# Altium project KorreKthor.PrjPcb
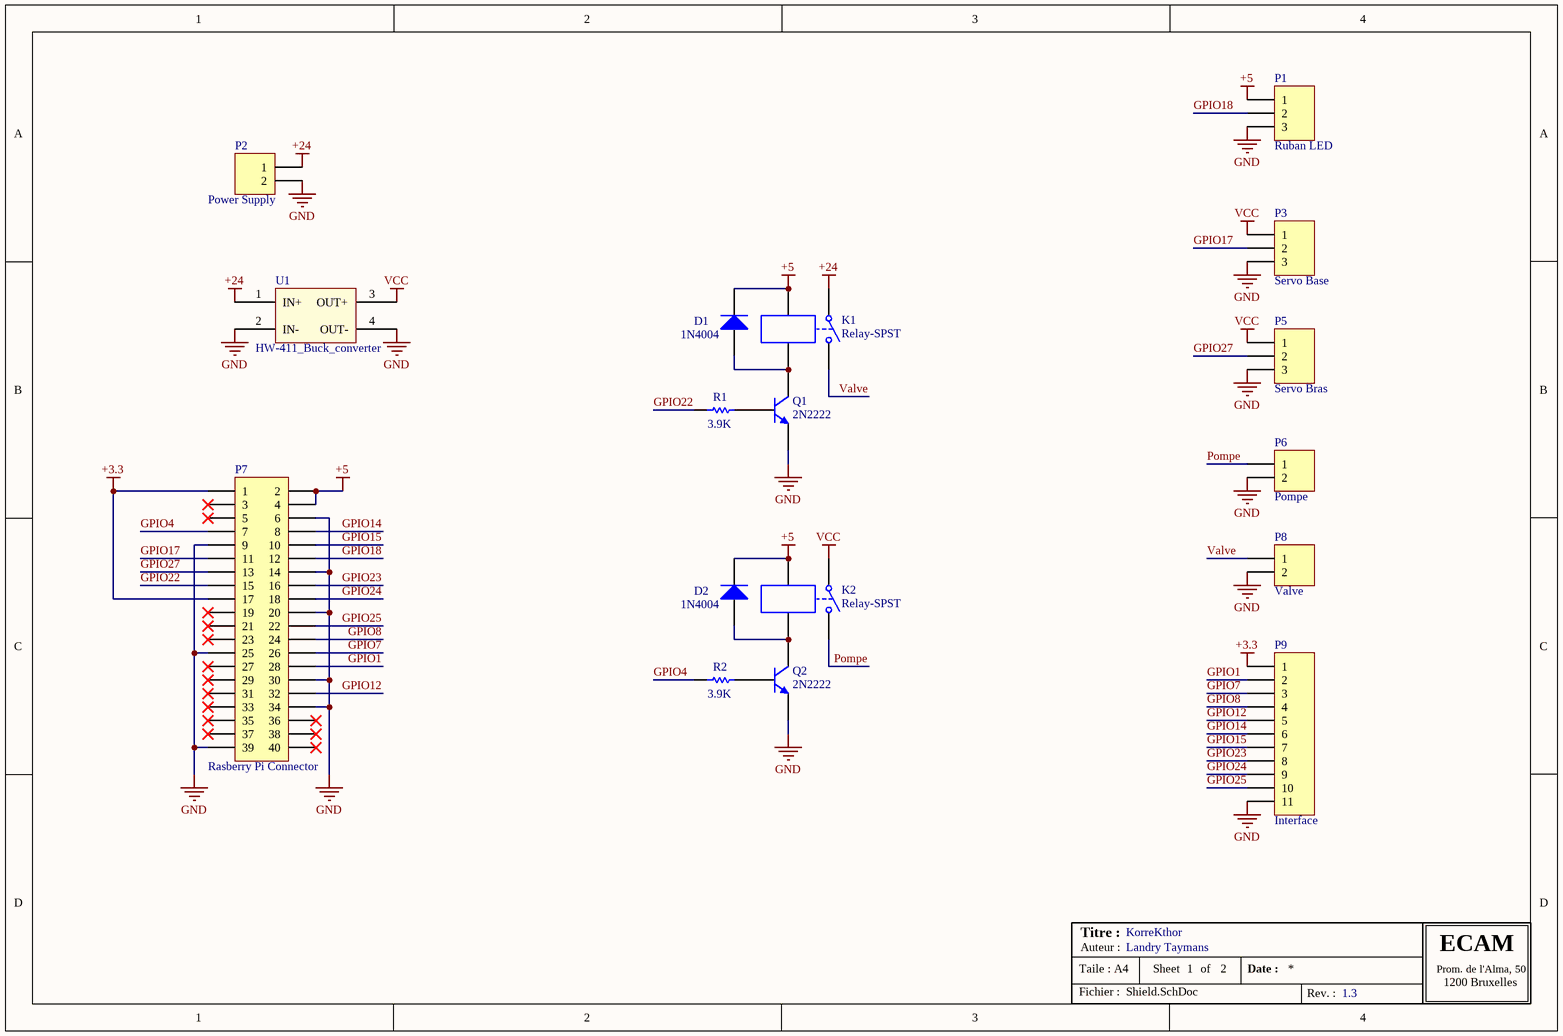
[diagram p0: Shield.SchDoc]
Auteur: Landry Taymans; Rev: 1.3; Titre: KorreKthor
2 sheets, 33 parts. Net scope: global (net labels, ports and power ports of the same name join across sheets).
Board files: Shield.PcbDoc, Interface.PcbDoc, mergePCB.PcbDoc
Sheets:
  Shield.SchDoc
  Interface.SchDoc

## Sheet Shield.SchDoc
size A4; SheetNumber: 1; SheetTotal: 2

### Parts
D1  1N4004  [DO-41]
D2  1N4004  [DO-41]
K1  Relay-SPST  [RELAY_OJE-SH_series]
K2  Relay-SPST  [RELAY_OJE-SH_series]
P1  Ruban LED  [Conn_1X3]
P2  Power Supply  [Bornier_1X2]
P3  Servo Base  [Conn_1X3]
P5  Servo Bras  [Conn_1X3]
P6  Pompe  [Bornier_1X2]
P7  Rasberry Pi Connector  [HDR2X20]
P8  Valve  [Bornier_1X2]
P9  Interface  [Conn_1X11]
Q1  2N2222  [TO-92]
Q2  2N2222  [TO-92]
R1  value 3.9K  [AXIAL-0.3]  (hidden comment: Res1)
R2  value 3.9K  [AXIAL-0.3]  (hidden comment: Res1)
U1  HW-411_Buck_converter  [HW-411_Buck_converter]

### Nets
+3.3: P7.1 P7.17 P9.1
+5: D1.2(K) D2.2(K) K1.3 K2.3 P1.1 P7.2 P7.4
+24: K1.1 P2.1 U1.1(IN+)
GND: P1.3 P2.2 P3.3 P5.3 P6.2 P7.6 P7.9 P7.14 P7.20 P7.25 P7.30 P7.34 P7.39 P8.2 P9.11 Q1.3(E) Q2.3(E) U1.2(IN-) U1.4(OUT-)
VCC: K2.1 P3.1 P5.1 U1.3(OUT+)
GPIO1: P7.28 P9.2
GPIO4: P7.7 R2.1
GPIO7: P7.26 P9.3
GPIO8: P7.24 P9.4
GPIO12: P7.32 P9.5
GPIO14: P7.8 P9.6
GPIO15: P7.10 P9.7
GPIO17: P3.2 P7.11
GPIO18: P1.2 P7.12
GPIO22: P7.15 R1.1
GPIO23: P7.16 P9.8
GPIO24: P7.18 P9.9
GPIO25: P7.22 P9.10
GPIO27: P5.2 P7.13
Pompe: K2.2 P6.1
Valve: K1.2 P8.1
NetD1_1: D1.1(A) K1.4 Q1.1(C)
NetD2_1: D2.1(A) K2.4 Q2.1(C)
NetQ1_2: Q1.2(B) R1.2
NetQ2_2: Q2.2(B) R2.2

Not connected (* = marked no-connect by the designer): P7 3* 5* 19* 21* 23* 27* 29* 31* 33* 35* 36* 37* 38* 40*

### Notes on the sheet
- Taile : A4
- Titre :
- Auteur :
- Sheet
- of
- Date :
- Prom. de l'Alma, 50
- ECAM
- 1200 Bruxelles
- Fichier :
- Rev. :

### Library data of the parts
D1 D2 = Diode 1N4004: 1 Amp General Purpose Rectifier; Published: 8-Jun-2000; LatestRevisionDate: 17-Jul-2002; LatestRevisionNote: Re-released for DXP Platform.; DatasheetVersion: 1998; PackageVersion: Aug-1999; PackageReference: DO-41; Publisher: Altium Limited; PackageDescription: Diode, Axial; Body 5.2 x 2.7 mm (LxDia. max), Lead Dia. 0.86 mm (max); Code_JEDEC: DO-204-AL; ComponentLink1Description: Manufacturer Link; ComponentLink1URL: http://www.fairchildsemi.com/; ComponentLink2Description: Datasheet; ComponentLink2URL: http://www.fairchildsemi.com/ds/1N%2F1N4001.pdf
K1 K2 = Relay-SPST: Single-Pole Single-Throw Relay; Published: 24-Mar-1999; LatestRevisionDate: 17-Jul-2002; LatestRevisionNote: Re-released for DXP Platform.; PackageReference: MODULE4; Publisher: Altium Limited
P1 P3 P5 = Header 3: Header, 3-Pin; LatestRevisionDate: 17-Jul-2002; LatestRevisionNote: Re-released for DXP Platform.; Publisher: Altium Limited
P2 P6 P8 = Header 2: Header, 2-Pin; LatestRevisionDate: 17-Jul-2002; LatestRevisionNote: Re-released for DXP Platform.; Publisher: Altium Limited
P7 = MHDR2X20: Header, 20-Pin, Dual row; LatestRevisionDate: 17-Jul-2002; LatestRevisionNote: Re-released for DXP Platform.; Publisher: Altium Limited
P9 = Header 11: Header, 11-Pin; LatestRevisionDate: 17-Jul-2002; LatestRevisionNote: Re-released for DXP Platform.; Publisher: Altium Limited
Q1 Q2 = NPN: NPN Bipolar Transistor; Published: 8-Jun-2000; LatestRevisionDate: 17-Jul-2002; LatestRevisionNote: Re-released for DXP Platform.; PackageReference: TO-226-AA; Publisher: Altium Limited; PackageDescription: TO, Flat Index; 3 In-Line, Axial Leads; Body Dia. 4.8mm; Leads 0.55 x 0.51 mm (max); Code_JEDEC: TO-226-AA
R1 R2 = Res1: Resistor; Published: 8-Jun-2000; LatestRevisionDate: 17-Jul-2002; LatestRevisionNote: Re-released for DXP Platform.; PackageReference: AXIAL-0.3; Publisher: Altium Limited; PackageDescription: Axial Device, Thru-Hole; 2 Leads; 0.3 in Pin Spacing
U1 = HW-411_Buck_converter: Buck converter board

## Sheet Interface.SchDoc
size A4; SheetNumber: 2; SheetTotal: 2
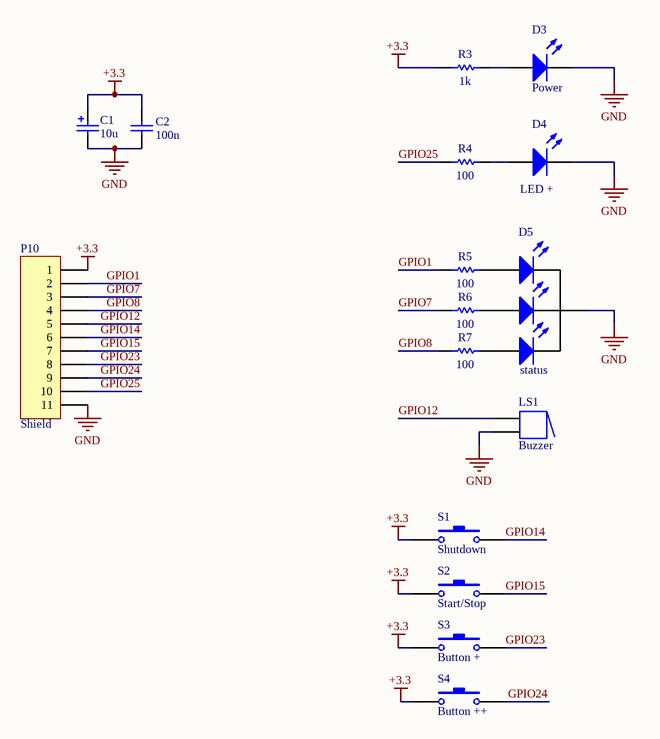
[diagram p1: Interface.SchDoc]

### Parts
C1  value 10u  [Rad5.2]  (hidden comment: Cap Pol1)
C2  value 100n  [RAD-0.2]  (hidden comment: Cap)
D3  Power  [LED_3MM]
D4  LED +  [LED_5mm]
D5  status  [LED RGB]
LS1  Buzzer  [Buzzer]
P10  Shield  [Conn_1X11]
R3  value 1k  [AXIAL-0.3]  (hidden comment: Res1)
R4  value 100  [AXIAL-0.3]  (hidden comment: Res1)
R5  value 100  [AXIAL-0.3]  (hidden comment: Res1)
R6  value 100  [AXIAL-0.3]  (hidden comment: Res1)
R7  value 100  [AXIAL-0.3]  (hidden comment: Res1)
S1  Shutdown  [SW_1825910-6-4]
S2  Start/Stop  [SW_1825910-6-4]
S3  Button +  [SW_1825910-6-4]
S4  Button ++  [SW_1825910-6-4]

### Nets
+3.3: C1.1 C2.1 P10.1 R3.1 S1.1 S2.1 S3.1 S4.1
GND: C1.2 C2.2 D3.2(K) D4.2(K) D5.2(K) LS1.2 P10.11
GPIO1: P10.2 R5.1
GPIO7: P10.3 R6.1
GPIO8: P10.4 R7.1
GPIO12: LS1.1 P10.5
GPIO14: P10.6 S1.2
GPIO15: P10.7 S2.2
GPIO23: P10.8 S3.2
GPIO24: P10.9 S4.2
GPIO25: P10.10 R4.1
NetD3_1: D3.1(A) R3.2
NetD4_1: D4.1(A) R4.2
NetD5_1: D5.1(R) R5.2
NetD5_3: D5.3(G) R6.2
NetD5_4: D5.4(B) R7.2

### Notes on the sheet
- Taile : A4
- Titre :
- Auteur :
- Sheet
- of
- Date :
- Prom. de l'Alma, 50
- ECAM
- 1200 Bruxelles
- Fichier :
- Rev. :

### Library data of the parts
C1 = Cap Pol1: Polarized Capacitor (Radial); Published: 8-Jun-2000; LatestRevisionDate: 17-Jul-2002; LatestRevisionNote: Re-released for DXP Platform.; PackageReference: RB7.6-15; Publisher: Altium Limited; PackageDescription: Polarized Capacitor (Radial); 2 Leads
C2 = Cap: Capacitor; Published: 8-Jun-2000; LatestRevisionDate: 17-Jul-2002; LatestRevisionNote: Re-released for DXP Platform.; PackageReference: RAD-0.3; Publisher: Altium Limited; PackageDescription: Radial Cap, Thru-Hole; 2 Leads; 0.3 in Pin Spacing
D3 D4 = LED0: Typical INFRARED GaAs LED; Published: 8-Jun-2000; LatestRevisionDate: 08-Jul-2005; LatestRevisionNote: Mech Layer 1 removed.; PackageReference: LED-0; Publisher: Altium Limited; PackageDescription: LED; 2 Leads
D5 = LED_RGB: Typical INFRARED GaAs LED; Published: 8-Jun-2000; LatestRevisionDate: 08-Jul-2005; LatestRevisionNote: Mech Layer 1 removed.; PackageReference: LED-0; Publisher: Altium Limited; PackageDescription: LED; 2 Leads
LS1 = Buzzer: Magnetic Transducer Buzzer; Published: 24-Mar-1999; LatestRevisionDate: 17-Dec-2003; LatestRevisionNote: Schematic revised, PCB Footprint replaced.; DatasheetVersion: 17-Dec-2003; PackageReference: ABSM-1574; Publisher: Altium Limited; PackageDescription: Magnetic Transducer Buzzer; ComponentLink1Description: Manufacturer Link; ComponentLink1URL: http://www.megastar.com/linecard/buzzmode/index.php
P10 = Header 11: Header, 11-Pin; LatestRevisionDate: 17-Jul-2002; LatestRevisionNote: Re-released for DXP Platform.; Publisher: Altium Limited
R3-R7 = Res1: Resistor; Published: 8-Jun-2000; LatestRevisionDate: 17-Jul-2002; LatestRevisionNote: Re-released for DXP Platform.; PackageReference: AXIAL-0.3; Publisher: Altium Limited; PackageDescription: Axial Device, Thru-Hole; 2 Leads; 0.3 in Pin Spacing
S1-S4 = SW-PB: Switch; Published: 24-Mar-1999; LatestRevisionDate: 17-Jul-2002; LatestRevisionNote: Re-released for DXP Platform.; PackageReference: SPST-2; Publisher: Altium Limited; PackageDescription: Switch; 2 Leads

## Nets that join several sheets
+3.3: Shield (P7.1 P7.17 P9.1), Interface (8 pins)
GND: Shield (19 pins), Interface (7 pins)
GPIO1: Shield (P7.28 P9.2), Interface (P10.2 R5.1)
GPIO7: Shield (P7.26 P9.3), Interface (P10.3 R6.1)
GPIO8: Shield (P7.24 P9.4), Interface (P10.4 R7.1)
GPIO12: Shield (P7.32 P9.5), Interface (LS1.1 P10.5)
GPIO14: Shield (P7.8 P9.6), Interface (P10.6 S1.2)
GPIO15: Shield (P7.10 P9.7), Interface (P10.7 S2.2)
GPIO23: Shield (P7.16 P9.8), Interface (P10.8 S3.2)
GPIO24: Shield (P7.18 P9.9), Interface (P10.9 S4.2)
GPIO25: Shield (P7.22 P9.10), Interface (P10.10 R4.1)